# Altium schematic sheet E-10 PMIC.SchDoc: FRDM-IMX93
size 513 x 386 mm; DrawnBy: FORLINX; Organization: ORGANIZATION; Address1: ADDRESS 1; Address2: ADDRESS 2; Address3: ADDRESS 3; Address4: ADDRESS 4; Revision: -; ENG_APP_DATE: --/--/--; DSN_APP_DATE: --/--/--; CHK_APP_DATE: --/--/--; Classification: Public, Company Internal/Proprietary, Company Confidential,  Company Secret; Page Create Date: March  8, 1995; OrgName: NXP Semiconductor; FIUO: A; OrgAddr1: NO. 192 Liangjing Rd. Pudong New Area, ShangHai; Page Number: 10; PageTitle: PMIC; Page Size: C; Page Count: 23; Designer: FORLINX; RevCode: B1; Approver: NXP SE; Doc: SCH-94611 PDF: SPF-94611; DsnPath: T:\FILES\Designs\Single Board Computers\i.MX93-FRDM\Design Files\SCH-94611_B1.DSN; SchematicName: FRDM-i.MX 93 Development Board; PageName: E-10 PMIC; PageSize: C; TopSchematic: True
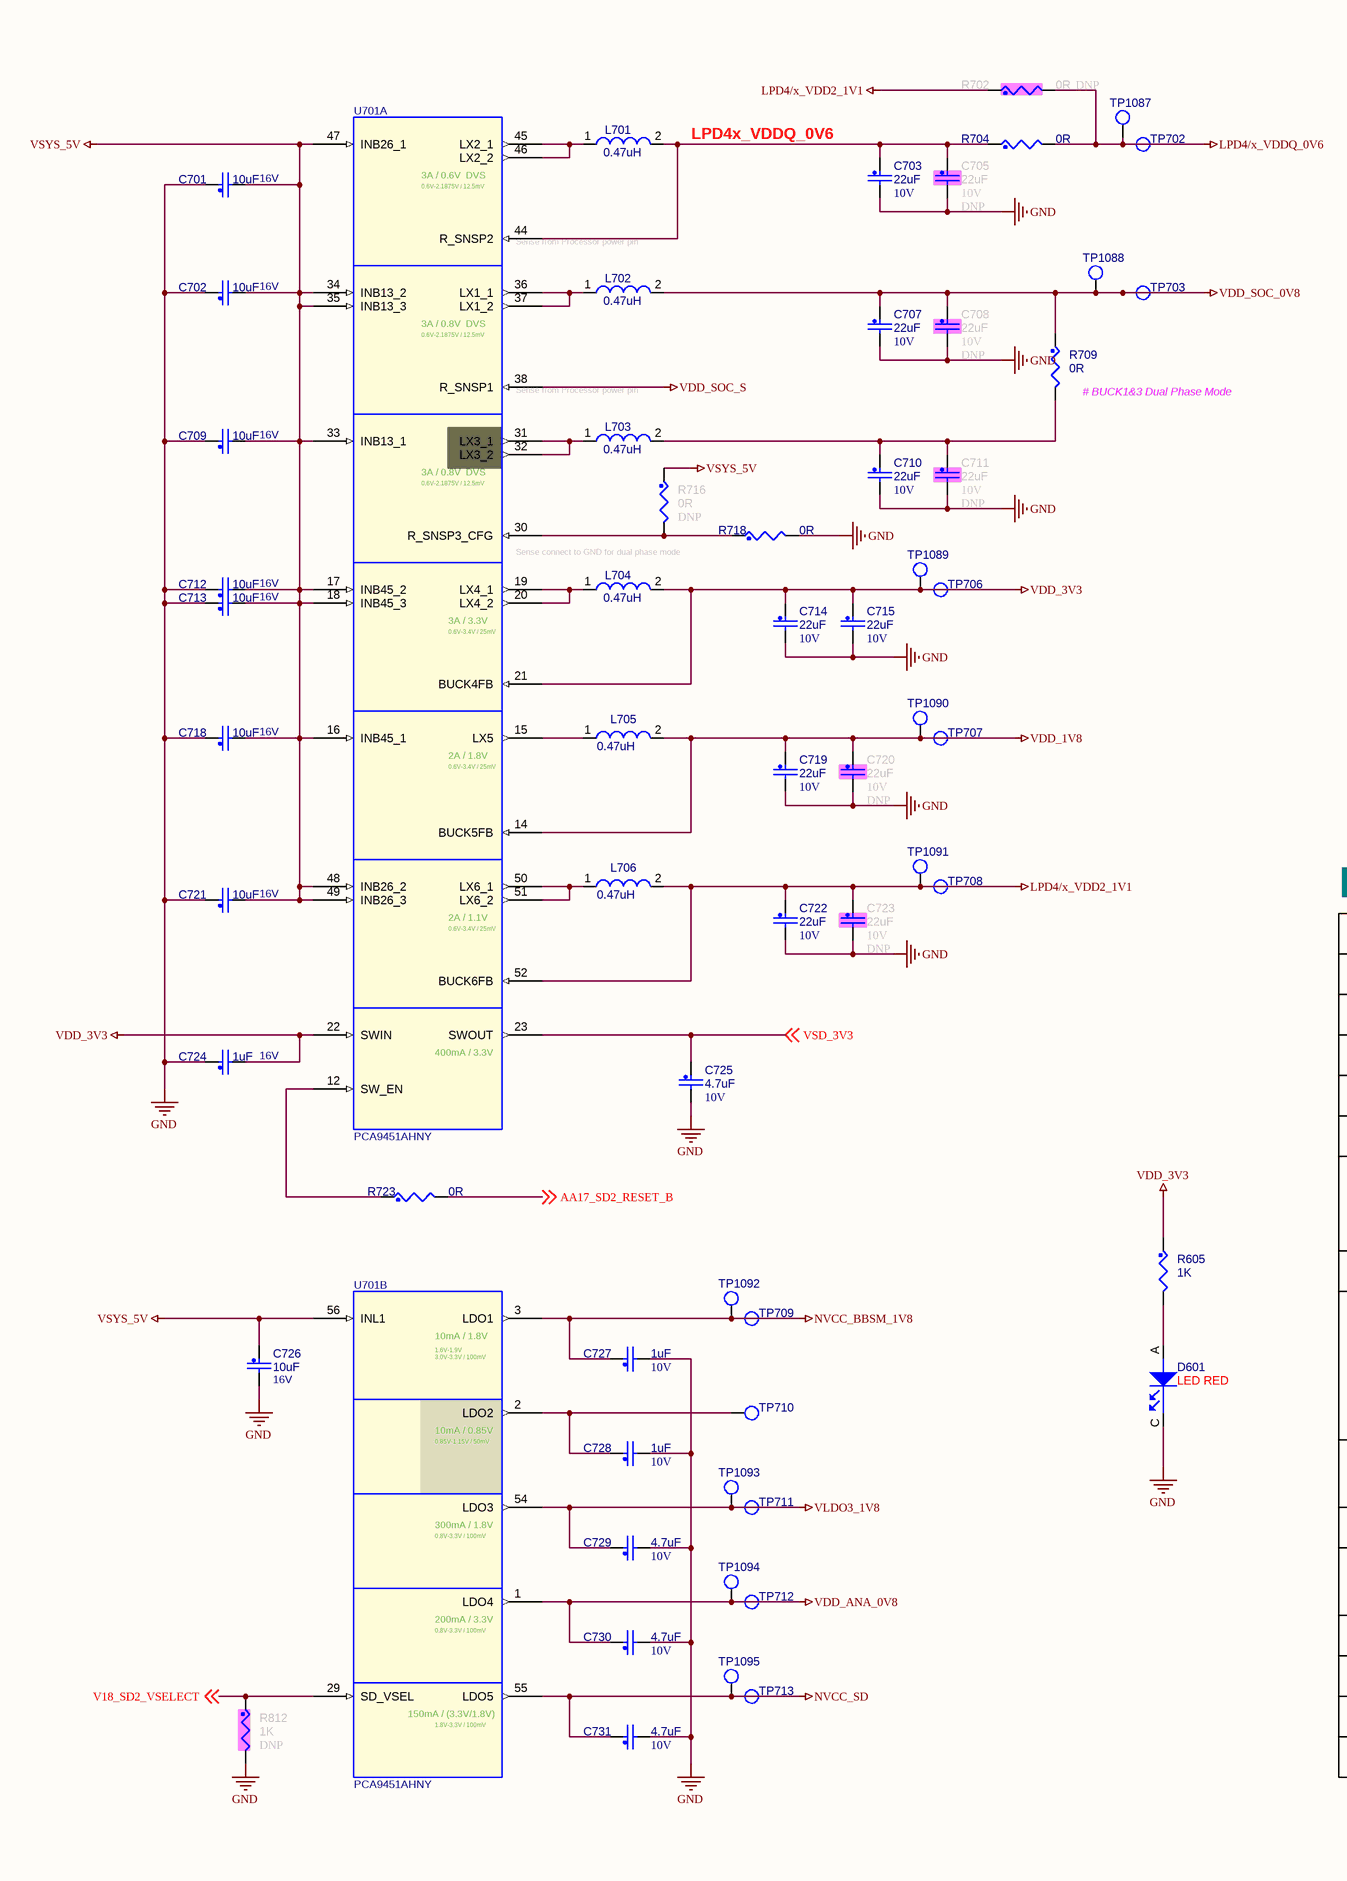
[diagram p0: E-10 PMIC.SchDoc, left]
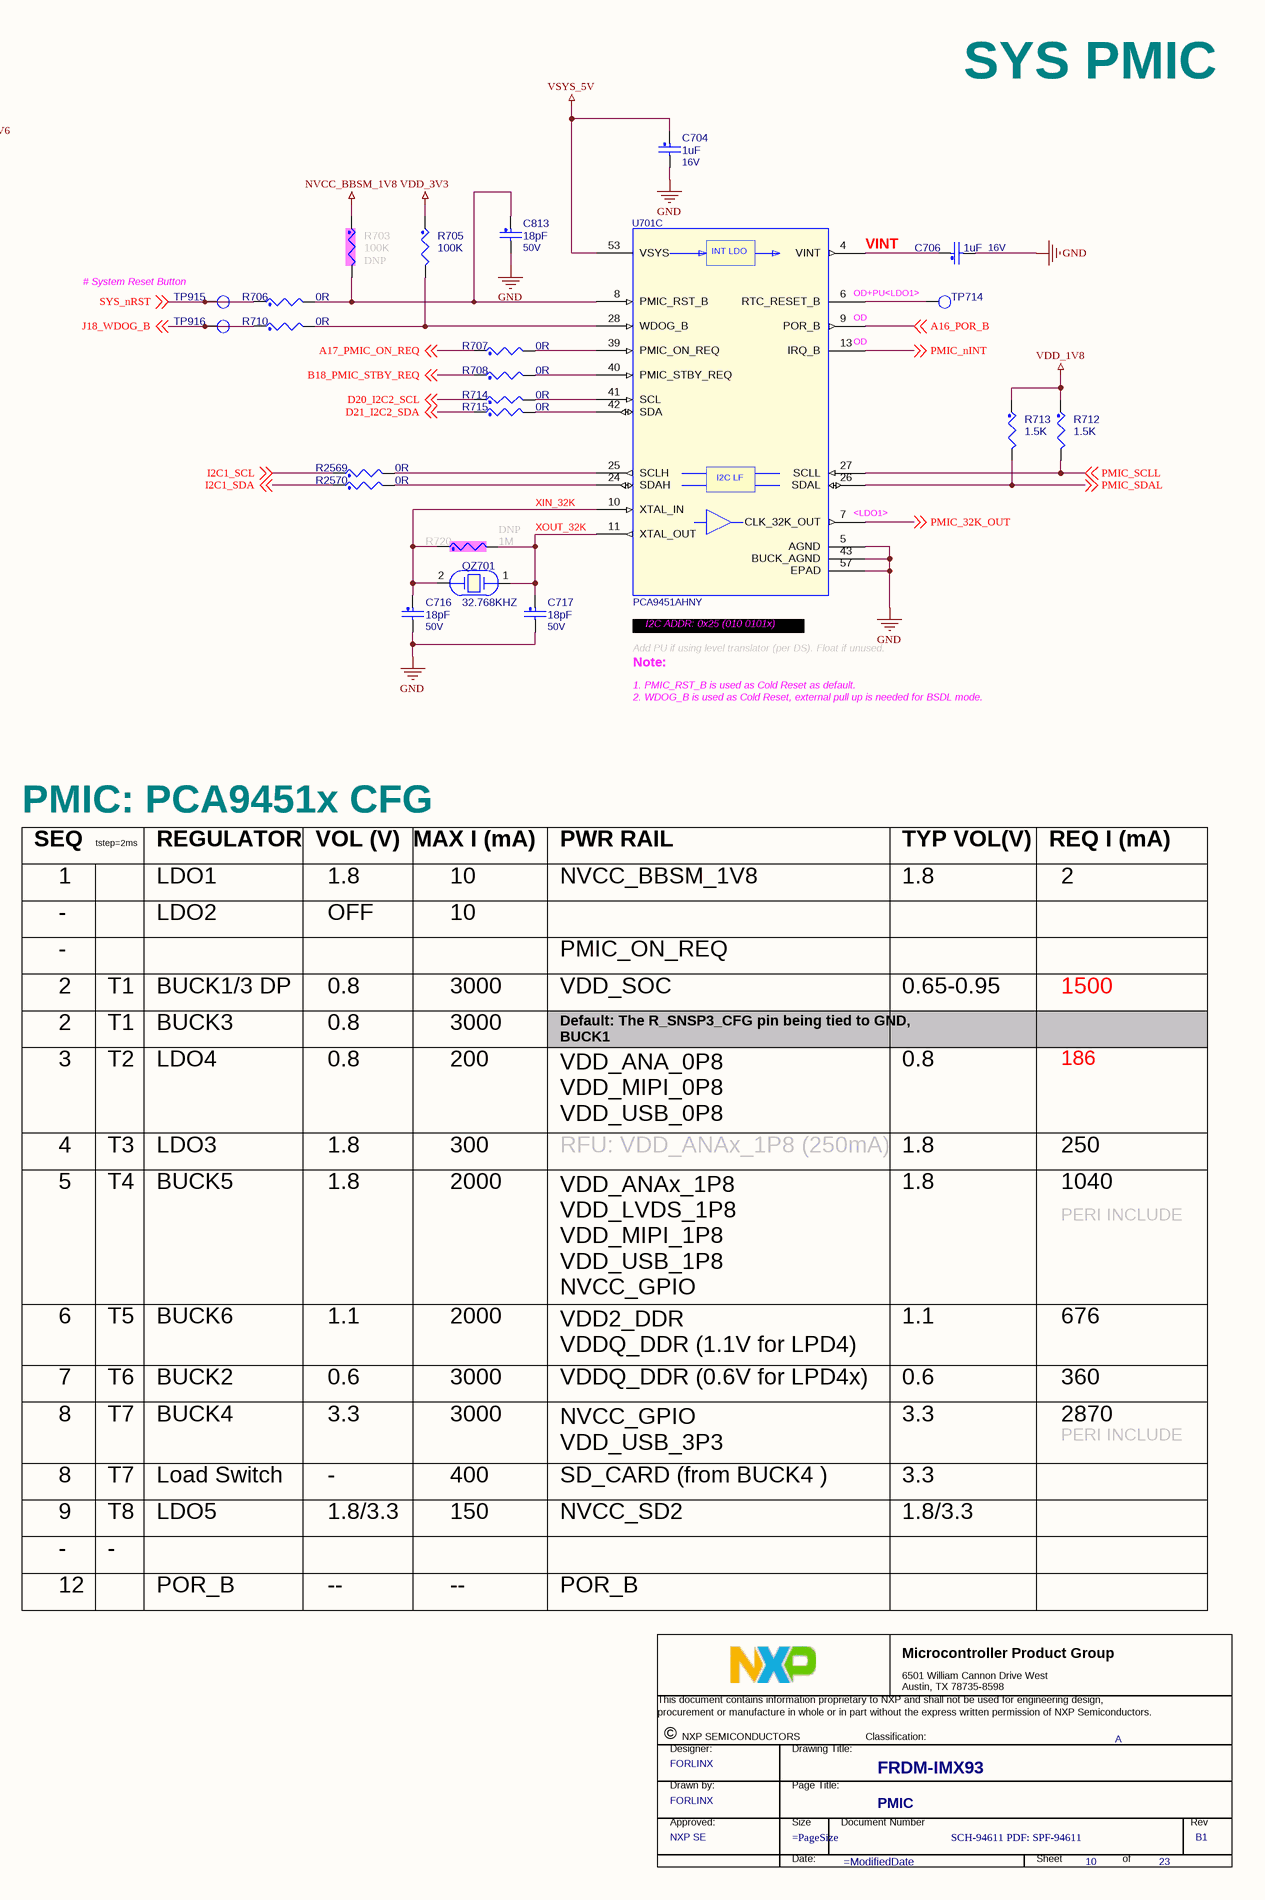
[diagram p1: E-10 PMIC.SchDoc, right]

## Parts
*  Title: FRDM-IMX93  RevCode: B1  PageTitle: PMIC  Page Number: 10  Page Count: 23  DrawnBy: FORLINX  Doc: SCH-94611 PDF: SPF-94611  Approver: NXP SE  FIUO: A  (graphical)
C701  10uF  VOLTAGE: 16V  [C0603]
C702  10uF  VOLTAGE: 16V  [C0603]
C703  22uF  VOLTAGE: 10V  [C0603]
C704  1uF  VOLTAGE: 16V  [C0402]
C705  22uF  ASSY_OPT: DNP  VOLTAGE: 10V  [C0603]
C706  1uF  VOLTAGE: 16V  [C0402]
C707  22uF  VOLTAGE: 10V  [C0603]
C708  22uF  ASSY_OPT: DNP  VOLTAGE: 10V  [C0603]
C709  10uF  VOLTAGE: 16V  [C0603]
C710  22uF  VOLTAGE: 10V  [C0603]
C711  22uF  ASSY_OPT: DNP  VOLTAGE: 10V  [C0603]
C712  10uF  VOLTAGE: 16V  [C0603]
C713  10uF  VOLTAGE: 16V  [C0603]
C714  22uF  VOLTAGE: 10V  [C0603]
C715  22uF  VOLTAGE: 10V  [C0603]
C716  18pF  VOLTAGE: 50V  [C0201]
C717  18pF  VOLTAGE: 50V  [C0201]
C718  10uF  VOLTAGE: 16V  [C0603]
C719  22uF  VOLTAGE: 10V  [C0603]
C720  22uF  ASSY_OPT: DNP  VOLTAGE: 10V  [C0603]
C721  10uF  VOLTAGE: 16V  [C0603]
C722  22uF  VOLTAGE: 10V  [C0603]
C723  22uF  ASSY_OPT: DNP  VOLTAGE: 10V  [C0603]
C724  1uF  VOLTAGE: 16V  [C0402]
C725  4.7uF  VOLTAGE: 10V  [C0402]
C726  10uF  VOLTAGE: 16V  [C0603]
C727  1uF  VOLTAGE: 10V  [C0201]
C728  1uF  VOLTAGE: 10V  [C0201]
C729  4.7uF  VOLTAGE: 10V  [C0402]
C730  4.7uF  VOLTAGE: 10V  [C0402]
C731  4.7uF  VOLTAGE: 10V  [C0402]
C813  18pF  VOLTAGE: 50V  [C0201]
D601  LED RED  [led0603]
L701  0.47uH  [IND_2016A]
L702  0.47uH  [IND_2016A]
L703  0.47uH  [IND_2016A]
L704  0.47uH  [IND_2016A]
L705  0.47uH  [IND_2016A]
L706  0.47uH  [IND_2016A]
QZ701  32.768KHZ  [XTAL2-3P2X1P5-SM]
R605  1K  [R0402]
R702  0R  ASSY_OPT: DNP  [R0603]
R703  100K  ASSY_OPT: DNP  [R0201]
R704  0R  [R0603]
R705  100K  [R0201]
R706  0R  [R0201]
R707  0R  [R0201]
R708  0R  [R0201]
R709  0R  [R0603]
R710  0R  [R0201]
R712  1.5K  [R0201]
R713  1.5K  [R0201]
R714  0R  [R0201]
R715  0R  [R0201]
R716  0R  ASSY_OPT: DNP  [R0402]
R718  0R  [R0402]
R720  1M  ASSY_OPT: DNP  [R0201]
R723  0R  [R0402]
R812  1K  ASSY_OPT: DNP  [R0402]
R2569  0R  [R0201]
R2570  0R  [R0201]
TP702  TPAD_020  [tpad_020]  (value not drawn)
TP703  TPAD_020  [tpad_020]  (value not drawn)
TP706  TPAD_020  [tpad_020]  (value not drawn)
TP707  TPAD_020  [tpad_020]  (value not drawn)
TP708  TPAD_020  [tpad_020]  (value not drawn)
TP709  TPAD_020  [tpad_020]  (value not drawn)
TP710  TPAD_020  [tpad_020]  (value not drawn)
TP711  TPAD_020  [tpad_020]  (value not drawn)
TP712  TPAD_020  [tpad_020]  (value not drawn)
TP713  TPAD_020  [tpad_020]  (value not drawn)
TP714  TPAD_015  [tpad_015]  (value not drawn)
TP915  TPAD_020  [tpad_020]  (value not drawn)
TP916  TPAD_020  [tpad_020]  (value not drawn)
TP1087  TPAD_020  [tpad_020]  (value not drawn)
TP1088  TPAD_020  [tpad_020]  (value not drawn)
TP1089  TPAD_020  [tpad_020]  (value not drawn)
TP1090  TPAD_020  [tpad_020]  (value not drawn)
TP1091  TPAD_020  [tpad_020]  (value not drawn)
TP1092  TPAD_020  [tpad_020]  (value not drawn)
TP1093  TPAD_020  [tpad_020]  (value not drawn)
TP1094  TPAD_020  [tpad_020]  (value not drawn)
TP1095  TPAD_020  [tpad_020]  (value not drawn)
U701  PCA9451AHNY  [hvqfn56_0p4_7x7_ep4p7mm]  (parts A,B,C of 3)

## Nets
GND: C701.1 C702.1 C703.2 C704.2 C705.2 C706.2 C707.2 C708.2 C709.1 C710.2 C711.2 C712.1 C713.1 C714.2 C715.2 C716.2 C717.2 C718.1 C719.2 C720.2 C721.1 C722.2 C723.2 C724.1 C725.2 C726.2 C727.2 C728.2 C729.2 C730.2 C731.2 C813.2 D601.C(CATHODE) R718.2 R812.2 U701.5(AGND) U701.43(BUCK_AGND) U701.57(EPAD)
LPD4/x_VDD2_1V1: C722.1 C723.1 L706.2 R702.1 TP708.1(TP) TP1091.1(TP) U701.52(BUCK6FB)
LPD4/x_VDDQ_0V6: R702.2 R704.2 TP702.1(TP) TP1087.1(TP)
NVCC_BBSM_1V8: C727.1 R703.1 TP709.1(TP) TP1092.1(TP) U701.3(LDO1)
NVCC_SD: C731.1 TP713.1(TP) TP1095.1(TP) U701.55(LDO5)
VDD_1V8: C719.1 C720.1 L705.2 R712.1 R713.1 TP707.1(TP) TP1090.1(TP) U701.14(BUCK5FB)
VDD_3V3: C714.1 C715.1 C724.2 L704.2 R605.1 R705.1 TP706.1(TP) TP1089.1(TP) U701.21(BUCK4FB) U701.22(SWIN)
VDD_ANA_0V8: C730.1 TP712.1(TP) TP1094.1(TP) U701.1(LDO4)
VDD_SOC_0V8: C707.1 C708.1 L702.2 R709.1 TP703.1(TP) TP1088.1(TP)
VDD_SOC_S: U701.38(R_SNSP1)
VLDO3_1V8: C729.1 TP711.1(TP) TP1093.1(TP) U701.54(LDO3)
VSYS_5V: C701.2 C702.2 C704.1 C709.2 C712.2 C713.2 C718.2 C721.2 C726.1 R716.1 U701.16(INB45_1) U701.17(INB45_2) U701.18(INB45_3) U701.33(INB13_1) U701.34(INB13_2) U701.35(INB13_3) U701.47(INB26_1) U701.48(INB26_2) U701.49(INB26_3) U701.53(VSYS) U701.56(INL1)
A16_POR_B: U701.9(POR_B) ; off-sheet A16_POR_B
A17_PMIC_ON_REQ: R707.1 ; off-sheet A17_PMIC_ON_REQ
AA17_SD2_RESET_B: R723.2 ; off-sheet AA17_SD2_RESET_B
B18_PMIC_STBY_REQ: R708.1 ; off-sheet B18_PMIC_STBY_REQ
D20_I2C2_SCL: R714.1 ; off-sheet D20_I2C2_SCL
D21_I2C2_SDA: R715.1 ; off-sheet D21_I2C2_SDA
I2C1_SCL: R2569.1 ; off-sheet I2C1_SCL
I2C1_SDA: R2570.1 ; off-sheet I2C1_SDA
J18_WDOG_B: R710.1 TP916.1(TP) ; off-sheet J18_WDOG_B
LPD4x_VDDQ_0V6: C703.1 C705.1 L701.2 R704.1 U701.44(R_SNSP2)
PMIC_32K_OUT: U701.7(CLK_32K_OUT) ; off-sheet PMIC_32K_OUT
PMIC_nINT: U701.13(IRQ_B) ; off-sheet PMIC_nINT
PMIC_SCLL: R712.2 U701.27(SCLL) ; off-sheet PMIC_SCLL
PMIC_SDAL: R713.2 U701.26(SDAL) ; off-sheet PMIC_SDAL
SYS_nRST: R706.1 TP915.1(TP) ; off-sheet SYS_nRST
V18_SD2_VSELECT: R812.1 U701.29(SD_VSEL) ; off-sheet V18_SD2_VSELECT
VINT: C706.1 U701.4(VINT)
VSD_3V3: C725.1 U701.23(SWOUT) ; off-sheet VSD_3V3
XIN_32K: C716.1 QZ701.2 R720.1 U701.10(XTAL_IN)
XOUT_32K: C717.1 QZ701.1 R720.2 U701.11(XTAL_OUT)
NetC710_1: C710.1 C711.1 L703.2 R709.2
NetC728_1: C728.1 TP710.1(TP) U701.2(LDO2)
NetC813_1: C813.1 R703.2 R706.2 U701.8(PMIC_RST_B)
NetD601_A: D601.A(ANODE) R605.2
NetL701_1: L701.1 U701.45(LX2_1) U701.46(LX2_2)
NetL702_1: L702.1 U701.36(LX1_1) U701.37(LX1_2)
NetL703_1: L703.1 U701.31(LX3_1) U701.32(LX3_2)
NetL704_1: L704.1 U701.19(LX4_1) U701.20(LX4_2)
NetL705_1: L705.1 U701.15(LX5)
NetL706_1: L706.1 U701.50(LX6_1) U701.51(LX6_2)
NetR705_2: R705.2 R710.2 U701.28(WDOG_B)
NetR707_2: R707.2 U701.39(PMIC_ON_REQ)
NetR708_2: R708.2 U701.40(PMIC_STBY_REQ)
NetR714_2: R714.2 U701.41(SCL)
NetR715_2: R715.2 U701.42(SDA)
NetR716_2: R716.2 R718.1 U701.30(R_SNSP3_CFG)
NetR723_1: R723.1 U701.12(SW_EN)
NetR2569_2: R2569.2 U701.25(SCLH)
NetR2570_2: R2570.2 U701.24(SDAH)
NetTP714_1: TP714.1(TP) U701.6(RTC_RESET_B)

## Notes on the sheet
- SYS PMIC
- (near U701) 3A / 0.6V  DVS
- (near U701) 0.6V-2.1875V / 12.5mV
- (near U701) Sense from Processor power pin
- (near U701) 3A / 0.8V  DVS
- # System Reset Button
- OD+PU<LDO1>
- (near R709) # BUCK1&3 Dual Phase Mode
- (near U701) OD
- (near U701) Sense connect to GND for dual phase mode
- (near U701) <LDO1>
- (near U701) 0.6V-3.4V / 25mV
- (near U701) 3A / 3.3V
- Note:
- Add PU if using level translator (per DS). Float if unused.
- I2C ADDR: 0x25 (010 0101x)
- (near U701) 2A / 1.8V
- 1. PMIC_RST_B is used as Cold Reset as default.
- 2. WDOG_B is used as Cold Reset, external pull up is needed for BSDL mode.
- (near U701) 2A / 1.1V
- PMIC: PCA9451x CFG
- SEQ
- tstep=2ms
- REGULATOR
- VOL (V)
- MAX I (mA)
- PWR RAIL
- TYP VOL(V)
- REQ I (mA)
- -
- 1
- LDO1
- LDO2
- OFF
- 1.8
- 10
- NVCC_BBSM_1V8
- 2
- (near U701) 400mA / 3.3V
- PMIC_ON_REQ
- T1
- BUCK1/3 DP
- BUCK3
- 0.8
- 3000
- VDD_SOC
- Default: The R_SNSP3_CFG pin being tied to GND, BUCK1
  and BUCK3 are configured as dual phase mode. Curr 6A.
- 0.65-0.95
- 1500
- 3
- T2
- LDO4
- 200
- 186
- 4
- T3
- LDO3
- 300
- RFU: VDD_ANAx_1P8 (250mA)
- VDD_ANA_0P8
  VDD_MIPI_0P8
  VDD_USB_0P8
- 250
- (near U701) 1.6V-1.9V
  3.0V-3.3V / 100mV
- (near U701) 10mA / 1.8V
- 5
- T4
- BUCK5
- 2000
- 1040
- PERI INCLUDE
- VDD_ANAx_1P8
  VDD_LVDS_1P8
  VDD_MIPI_1P8
  VDD_USB_1P8
  NVCC_GPIO
- (near U701) 0.85V-1.15V / 50mV
- (near U701) 10mA / 0.85V
- 6
- T5
- BUCK6
- 1.1
- VDD2_DDR
  VDDQ_DDR (1.1V for LPD4)
- 676
- (near U701) 0.8V-3.3V / 100mV
- (near U701) 300mA / 1.8V
- 7
- T6
- BUCK2
- 0.6
- VDDQ_DDR (0.6V for LPD4x)
- 360
- (near U701) 200mA / 3.3V
- 8
- T7
- BUCK4
- 3.3
- NVCC_GPIO
  VDD_USB_3P3
- 2870
- 9
- T8
- LDO5
- Load Switch
- 1.8/3.3
- 150
- 400
- SD_CARD (from BUCK4 )
- NVCC_SD2
- (near U701) 150mA / (3.3V/1.8V)
- (near U701) 1.8V-3.3V / 100mV
- 12
- POR_B
- --
- DWG. NO.
- REV.
- SHT.
- REVISION
- DESCRIPTION
- DATE
- APPROVED
- ENG:
- APPROVALS
- quilter.ai <http://quilter.ai>
- DSN:
- CHK:
- REFERENCE DOCUMENTS
- TITLE
- PROJECT
- BOM:
- FAB DWG:
- PCB DWG:
- ASSY DWG:
- SIZE
- FILE NAME
- C
- DWG NO.
- SHEET
- OF
- REV
- (in symbol PCA9451AHNY, part C) INT LDO; I2C LF
- (in symbol TitleBlock_MCPG) Microcontroller Product Group; 6501 William Cannon Drive West / Austin, TX 78735-8598; This document contains information proprietary to NXP and shall not be used for engineering design,; procurement or manufacture in whole or in part without the express written permission of NXP Semiconductors.; ©; NXP SEMICONDUCTORS; Classification:; Designer:; Drawing Title:; Drawn by:; Page Title:; Approved:; Size; Document Number; Rev; Date:; Sheet; of

## Library data of the parts
* = TitleBlock_MCPG: Classification: Public, Company Internal/Proprietary, Company Confidential,  Company Secret; OrgAddr1: NO. 192 Liangjing Rd. Pudong New Area, ShangHai; OrgName: NXP Semiconductor; Page Size: =PageSize; Page Create Date: March  8, 1995; Designer: FORLINX; Page Modify Date: =ModifiedDate
C701 = CAP_NP: 0603,10uF,10V,+/-20%,X5R; Part Reference: C701; CLASS: DISCRETE; Temp Range: -55¡ãC to +85¡ãC; FPLIST: CC0603_OV,CC0603,0603_CC,cc0603_0805_nsp; CAD_APPROVED: Yes; MFG_PN01: 0603X106M100NT; MFG_NAME01: FENGHUA; Tolerance: 10%; Value: 10uF; Package Type: SMT; Package Size: 0603; HEIGHT: 0.9MM; Temp_Range: -55¡ãC to +85¡ãC; ROHS: Yes; PCB Footprint: C0603
C702 = CAP_NP: 0603,10uF,10V,+/-20%,X5R; Part Reference: C702; CLASS: DISCRETE; Temp Range: -55¡ãC to +85¡ãC; Tolerance: 10%; MFG_NAME01: FENGHUA; MFG_PN01: 0603X106M100NT; CAD_APPROVED: Yes; FPLIST: CC0603_OV,CC0603,0603_CC,cc0603_0805_nsp; Value: 10uF; Package Type: SMT; Package Size: 0603; ROHS: Yes; Temp_Range: -55¡ãC to +85¡ãC; HEIGHT: 0.9MM; PCB Footprint: C0603
C703 = CAP_NP: 0603,22uF,6.3V,+/-20%,X5R; Part Reference: C703; CLASS: DISCRETE; SIGNAL_MODEL: DEFAULT_CAPACITOR_2.2e+07pF_2_1; Tolerance: 20%; MFG_NAME01: SAMSUNG; MFG_PN01: CL10A226MQ8NRNC; CAD_APPROVED: Yes; FPLIST: CC0603_OV,CC0603,0603_cc_tol; Value: 22uF; Package Size: 0603; WVDC: 6.3V; ROHS: Yes; HEIGHT: 1MM; PCB Footprint: C0603
C704 = CAP_NP: 0402,1uF,16V,+/-10%,X5R; Part Reference: C704; CLASS: DISCRETE; MFG_PN01: CL05A105KO5NNNC; MFG_NAME01: SAMSUNG; CAD_APPROVED: Yes; Tolerance: 10%; FPLIST: CC0402_25,CC0402_HD,0402_CC,capc0402_l; Value: 1uF; ROHS: Yes; HEIGHT: 0.55 MM; PCB Footprint: C0402
C705 = CAP_NP: 0603,22uF,6.3V,+/-20%,X5R; Part Reference: C705; CLASS: DISCRETE; Tolerance: 20%; MFG_NAME01: SAMSUNG; MFG_PN01: CL10A226MQ8NRNC; CAD_APPROVED: Yes; FPLIST: CC0603_OV,CC0603,0603_cc_tol; SIGNAL_MODEL: DEFAULT_CAPACITOR_2.2e+07pF_2_1; Value: 22uF; Package Size: 0603; WVDC: 6.3V; ROHS: Yes; HEIGHT: 1MM; PCB Footprint: C0603
C706 = CAP_NP: 0402,1uF,16V,+/-10%,X5R; Part Reference: C706; CLASS: DISCRETE; FPLIST: CC0402_25,CC0402_HD,0402_CC,capc0402_l; Tolerance: 10%; CAD_APPROVED: Yes; MFG_NAME01: SAMSUNG; MFG_PN01: CL05A105KO5NNNC; Value: 1uF; HEIGHT: 0.55 MM; ROHS: Yes; PCB Footprint: C0402
C707 = CAP_NP: 0603,22uF,6.3V,+/-20%,X5R; Part Reference: C707; CLASS: DISCRETE; FPLIST: CC0603_OV,CC0603,0603_cc_tol; CAD_APPROVED: Yes; MFG_PN01: CL10A226MQ8NRNC; MFG_NAME01: SAMSUNG; Tolerance: 20%; SIGNAL_MODEL: DEFAULT_CAPACITOR_2.2e+07pF_2_1; Value: 22uF; Package Size: 0603; HEIGHT: 1MM; ROHS: Yes; WVDC: 6.3V; PCB Footprint: C0603
C708 = CAP_NP: 0603,22uF,6.3V,+/-20%,X5R; Part Reference: C708; CLASS: DISCRETE; SIGNAL_MODEL: DEFAULT_CAPACITOR_2.2e+07pF_2_1; FPLIST: CC0603_OV,CC0603,0603_cc_tol; CAD_APPROVED: Yes; MFG_PN01: CL10A226MQ8NRNC; MFG_NAME01: SAMSUNG; Tolerance: 20%; Value: 22uF; HEIGHT: 1MM; ROHS: Yes; WVDC: 6.3V; Package Size: 0603; PCB Footprint: C0603
C709 = CAP_NP: 0603,10uF,10V,+/-20%,X5R; Part Reference: C709; CLASS: DISCRETE; Temp Range: -55¡ãC to +85¡ãC; Tolerance: 10%; MFG_NAME01: FENGHUA; MFG_PN01: 0603X106M100NT; CAD_APPROVED: Yes; FPLIST: CC0603_OV,CC0603,0603_CC,cc0603_0805_nsp; Value: 10uF; Package Type: SMT; Package Size: 0603; ROHS: Yes; Temp_Range: -55¡ãC to +85¡ãC; HEIGHT: 0.9MM; PCB Footprint: C0603
C710 = CAP_NP: 0603,22uF,6.3V,+/-20%,X5R; Part Reference: C710; CLASS: DISCRETE; SIGNAL_MODEL: DEFAULT_CAPACITOR_2.2e+07pF_2_1; Tolerance: 20%; MFG_NAME01: SAMSUNG; MFG_PN01: CL10A226MQ8NRNC; CAD_APPROVED: Yes; FPLIST: CC0603_OV,CC0603,0603_cc_tol; Value: 22uF; Package Size: 0603; WVDC: 6.3V; ROHS: Yes; HEIGHT: 1MM; PCB Footprint: C0603
C711 = CAP_NP: 0603,22uF,6.3V,+/-20%,X5R; Part Reference: C711; CLASS: DISCRETE; Tolerance: 20%; MFG_NAME01: SAMSUNG; MFG_PN01: CL10A226MQ8NRNC; CAD_APPROVED: Yes; FPLIST: CC0603_OV,CC0603,0603_cc_tol; SIGNAL_MODEL: DEFAULT_CAPACITOR_2.2e+07pF_2_1; Value: 22uF; WVDC: 6.3V; ROHS: Yes; HEIGHT: 1MM; Package Size: 0603; PCB Footprint: C0603
C712 = CAP_NP: 0603,10uF,10V,+/-20%,X5R; Part Reference: C712; CLASS: DISCRETE; FPLIST: CC0603_OV,CC0603,0603_CC,cc0603_0805_nsp; CAD_APPROVED: Yes; Temp_Range: -55¡ãC to +85¡ãC; MFG_PN01: 0603X106M100NT; MFG_NAME01: FENGHUA; Tolerance: 10%; Value: 10uF; HEIGHT: 0.9MM; ROHS: Yes; Package Size: 0603; Package Type: SMT; Temp Range: -55¡ãC to +85¡ãC; PCB Footprint: C0603
C713 = CAP_NP: 0603,10uF,10V,+/-20%,X5R; Part Reference: C713; CLASS: DISCRETE; Temp Range: -55¡ãC to +85¡ãC; Tolerance: 10%; MFG_NAME01: FENGHUA; MFG_PN01: 0603X106M100NT; CAD_APPROVED: Yes; FPLIST: CC0603_OV,CC0603,0603_CC,cc0603_0805_nsp; Value: 10uF; Package Type: SMT; Package Size: 0603; ROHS: Yes; Temp_Range: -55¡ãC to +85¡ãC; HEIGHT: 0.9MM; PCB Footprint: C0603
C714 = CAP_NP: 0603,22uF,6.3V,+/-20%,X5R; Part Reference: C714; CLASS: DISCRETE; SIGNAL_MODEL: DEFAULT_CAPACITOR_2.2e+07pF_2_1; Tolerance: 20%; MFG_NAME01: SAMSUNG; MFG_PN01: CL10A226MQ8NRNC; CAD_APPROVED: Yes; FPLIST: CC0603_OV,CC0603,0603_cc_tol; Value: 22uF; Package Size: 0603; WVDC: 6.3V; ROHS: Yes; HEIGHT: 1MM; PCB Footprint: C0603
C715 = CAP_NP: 0603,22uF,6.3V,+/-20%,X5R; Part Reference: C715; CLASS: DISCRETE; SIGNAL_MODEL: DEFAULT_CAPACITOR_2.2e+07pF_2_1; FPLIST: CC0603_OV,CC0603,0603_cc_tol; CAD_APPROVED: Yes; MFG_PN01: CL10A226MQ8NRNC; MFG_NAME01: SAMSUNG; Tolerance: 20%; Value: 22uF; Package Size: 0603; HEIGHT: 1MM; ROHS: Yes; WVDC: 6.3V; PCB Footprint: C0603
C716 = CAP_NP: 0201,18pF,50V,+/-5%,NPO; Part Reference: C716; CLASS: DISCRETE; FPLIST: CC0201,CC0201_HD,0201_CC; CAD_APPROVED: Yes; MFG_PN01: 0201CG180J500NT; MFG_NAME01: FENGHUA; Tolerance: 5%; Value: 18pF; Package Type: &#966;180mm Paper taping; Package Size: 0201; HEIGHT: 0.33MM; ROHS: Yes; PCB Footprint: C0201
C717 = CAP_NP: 0201,18pF,50V,+/-5%,NPO; Part Reference: C717; CLASS: DISCRETE; FPLIST: CC0201,CC0201_HD,0201_CC; CAD_APPROVED: Yes; MFG_PN01: 0201CG180J500NT; MFG_NAME01: FENGHUA; Tolerance: 5%; Value: 18pF; HEIGHT: 0.33MM; ROHS: Yes; Package Size: 0201; Package Type: &#966;180mm Paper taping; PCB Footprint: C0201
C718 = CAP_NP: 0603,10uF,10V,+/-20%,X5R; Part Reference: C718; CLASS: DISCRETE; FPLIST: CC0603_OV,CC0603,0603_CC,cc0603_0805_nsp; CAD_APPROVED: Yes; Temp_Range: -55¡ãC to +85¡ãC; MFG_PN01: 0603X106M100NT; MFG_NAME01: FENGHUA; Tolerance: 10%; Value: 10uF; HEIGHT: 0.9MM; ROHS: Yes; Package Size: 0603; Package Type: SMT; Temp Range: -55¡ãC to +85¡ãC; PCB Footprint: C0603
C719 = CAP_NP: 0603,22uF,6.3V,+/-20%,X5R; Part Reference: C719; CLASS: DISCRETE; SIGNAL_MODEL: DEFAULT_CAPACITOR_2.2e+07pF_2_1; Tolerance: 20%; MFG_NAME01: SAMSUNG; MFG_PN01: CL10A226MQ8NRNC; CAD_APPROVED: Yes; FPLIST: CC0603_OV,CC0603,0603_cc_tol; Value: 22uF; Package Size: 0603; WVDC: 6.3V; ROHS: Yes; HEIGHT: 1MM; PCB Footprint: C0603
C720 = CAP_NP: 0603,22uF,6.3V,+/-20%,X5R; Part Reference: C720; CLASS: DISCRETE; SIGNAL_MODEL: DEFAULT_CAPACITOR_2.2e+07pF_2_1; FPLIST: CC0603_OV,CC0603,0603_cc_tol; CAD_APPROVED: Yes; MFG_PN01: CL10A226MQ8NRNC; MFG_NAME01: SAMSUNG; Tolerance: 20%; Value: 22uF; Package Size: 0603; HEIGHT: 1MM; ROHS: Yes; WVDC: 6.3V; PCB Footprint: C0603
C721 = CAP_NP: 0603,10uF,10V,+/-20%,X5R; Part Reference: C721; CLASS: DISCRETE; FPLIST: CC0603_OV,CC0603,0603_CC,cc0603_0805_nsp; CAD_APPROVED: Yes; Temp_Range: -55¡ãC to +85¡ãC; MFG_PN01: 0603X106M100NT; MFG_NAME01: FENGHUA; Tolerance: 10%; Value: 10uF; HEIGHT: 0.9MM; ROHS: Yes; Package Size: 0603; Package Type: SMT; Temp Range: -55¡ãC to +85¡ãC; PCB Footprint: C0603
C722 = CAP_NP: 0603,22uF,6.3V,+/-20%,X5R; Part Reference: C722; CLASS: DISCRETE; SIGNAL_MODEL: DEFAULT_CAPACITOR_2.2e+07pF_2_1; Tolerance: 20%; MFG_NAME01: SAMSUNG; MFG_PN01: CL10A226MQ8NRNC; CAD_APPROVED: Yes; FPLIST: CC0603_OV,CC0603,0603_cc_tol; Value: 22uF; Package Size: 0603; WVDC: 6.3V; ROHS: Yes; HEIGHT: 1MM; PCB Footprint: C0603
C723 = CAP_NP: 0603,22uF,6.3V,+/-20%,X5R; Part Reference: C723; CLASS: DISCRETE; Tolerance: 20%; MFG_NAME01: SAMSUNG; MFG_PN01: CL10A226MQ8NRNC; CAD_APPROVED: Yes; FPLIST: CC0603_OV,CC0603,0603_cc_tol; SIGNAL_MODEL: DEFAULT_CAPACITOR_2.2e+07pF_2_1; Value: 22uF; WVDC: 6.3V; ROHS: Yes; HEIGHT: 1MM; Package Size: 0603; PCB Footprint: C0603
C724 = CAP_NP: 0402,1uF,16V,+/-10%,X5R; Part Reference: C724; CLASS: DISCRETE; MFG_PN01: CL05A105KO5NNNC; MFG_NAME01: SAMSUNG; CAD_APPROVED: Yes; Tolerance: 10%; FPLIST: CC0402_25,CC0402_HD,0402_CC,capc0402_l; Value: 1uF; ROHS: Yes; HEIGHT: 0.55 MM; PCB Footprint: C0402
C725 = CAP_NP: 0402,4.7uF,10V,+/-10%,X5R; Part Reference: C725; CLASS: DISCRETE; 3D_Mechanical_Footprint_File: cc0402_tol0p15; FPLIST: cc0402_tol0p15,cc0402_tol0p15_ov,0402_cc_nsp; CAD_APPROVED: Yes; MFG_PN01: CL05A475KP5NRNC; MFG_NAME01: SAMSUNG; Tolerance: 10%; Value: 4.7uF; HEIGHT: 0.65MM; ROHS: Yes; PCB Footprint: C0402
C726 = CAP_NP: 0603,10uF,10V,+/-20%,X5R; Part Reference: C726; CLASS: DISCRETE; Temp Range: -55¡ãC to +85¡ãC; FPLIST: CC0603_OV,CC0603,0603_CC,cc0603_0805_nsp; CAD_APPROVED: Yes; MFG_PN01: 0603X106M100NT; MFG_NAME01: FENGHUA; Tolerance: 10%; Value: 10uF; Package Type: SMT; Package Size: 0603; HEIGHT: 0.9MM; Temp_Range: -55¡ãC to +85¡ãC; ROHS: Yes; PCB Footprint: C0603
C727 = CAP_NP: 0201,1uF,10V,+/-20%,X5R; Part Reference: C727; CLASS: DISCRETE; Tolerance: 10%; MFG_NAME01: SAMSUNG; MFG_PN01: CL03A105MP3NSNC; CAD_APPROVED: Yes; FPLIST: CC0201,CC0201_HD,0201_CC,cc_0201_cir; Temp Range: -55¡ãC to 85¡ãC; Value: 1uF; ROHS: Yes; HEIGHT: 0.35MM; Package Size: 0201 (0603 Metric); Package Type: SMD/SMT; PCB Footprint: C0201
C728 = CAP_NP: 0201,1uF,10V,+/-20%,X5R; Part Reference: C728; CLASS: DISCRETE; Tolerance: 10%; MFG_NAME01: SAMSUNG; MFG_PN01: CL03A105MP3NSNC; CAD_APPROVED: Yes; FPLIST: CC0201,CC0201_HD,0201_CC,cc_0201_cir; Temp Range: -55¡ãC to 85¡ãC; Value: 1uF; Package Type: SMD/SMT; Package Size: 0201 (0603 Metric); ROHS: Yes; HEIGHT: 0.35MM; PCB Footprint: C0201
C729 = CAP_NP: 0402,4.7uF,10V,+/-10%,X5R; Part Reference: C729; CLASS: DISCRETE; 3D_Mechanical_Footprint_File: cc0402_tol0p15; Tolerance: 10%; MFG_NAME01: SAMSUNG; MFG_PN01: CL05A475KP5NRNC; CAD_APPROVED: Yes; FPLIST: cc0402_tol0p15,cc0402_tol0p15_ov,0402_cc_nsp; Value: 4.7uF; ROHS: Yes; HEIGHT: 0.65MM; PCB Footprint: C0402
C730 = CAP_NP: 0402,4.7uF,10V,+/-10%,X5R; Part Reference: C730; CLASS: DISCRETE; 3D_Mechanical_Footprint_File: cc0402_tol0p15; Tolerance: 10%; MFG_NAME01: SAMSUNG; MFG_PN01: CL05A475KP5NRNC; CAD_APPROVED: Yes; FPLIST: cc0402_tol0p15,cc0402_tol0p15_ov,0402_cc_nsp; Value: 4.7uF; ROHS: Yes; HEIGHT: 0.65MM; PCB Footprint: C0402
C731 = CAP_NP: 0402,4.7uF,10V,+/-10%,X5R; Part Reference: C731; CLASS: DISCRETE; 3D_Mechanical_Footprint_File: cc0402_tol0p15; Tolerance: 10%; MFG_NAME01: SAMSUNG; MFG_PN01: CL05A475KP5NRNC; CAD_APPROVED: Yes; FPLIST: cc0402_tol0p15,cc0402_tol0p15_ov,0402_cc_nsp; Value: 4.7uF; ROHS: Yes; HEIGHT: 0.65MM; PCB Footprint: C0402
C813 = CAP_NP: 0201,18pF,50V,+/-5%,NPO; Part Reference: C813; CLASS: DISCRETE; Tolerance: 5%; MFG_NAME01: FENGHUA; MFG_PN01: 0201CG180J500NT; CAD_APPROVED: Yes; FPLIST: CC0201,CC0201_HD,0201_CC; Value: 18pF; Package Type: &#966;180mm Paper taping; Package Size: 0201; ROHS: Yes; HEIGHT: 0.33MM; PCB Footprint: C0201
D601 = LED: LED RED SGL 25MA SMT 0603; Part Reference: D601; CLASS: IC; VOLTAGE: 2V; MFG_NAME01: Harvatek; MFG_PN01: HQ19-2132SURC62(Y); CAD_APPROVED: Yes; Value: LED RED; ROHS: Yes; HEIGHT: 0.8 MM; PCB Footprint: led0603
L701 = INDUCTOR: 0.47uH+/-20%,2.0*1.6*1.2,3.4A/3.95A; Part Reference: L701; PART_TYPE: INDUCTOR\POWER; CLASS: DISCRETE; Tolerance: 20%; CAD_APPROVED: Yes; Temp_Range: -40¡ãC to +125¡ãC; MFG_PN01: WPN201612HR47MT; MFG_NAME01: Sunlord; Value: 0.47uH; HEIGHT: 1.2MM; ROHS: Yes; TOL: 20%; Temp Range: -40¡ãC to +125¡ãC; PCB Footprint: IND_2016A
L702 = INDUCTOR: 0.47uH+/-20%,2.0*1.6*1.2,3.4A/3.95A; Part Reference: L702; PART_TYPE: INDUCTOR\POWER; CLASS: DISCRETE; Temp Range: -40¡ãC to +125¡ãC; Tolerance: 20%; MFG_NAME01: Sunlord; MFG_PN01: WPN201612HR47MT; CAD_APPROVED: Yes; Value: 0.47uH; TOL: 20%; ROHS: Yes; Temp_Range: -40¡ãC to +125¡ãC; HEIGHT: 1.2MM; PCB Footprint: IND_2016A
L703 = INDUCTOR: 0.47uH+/-20%,2.0*1.6*1.2,3.4A/3.95A; Part Reference: L703; PART_TYPE: INDUCTOR\POWER; CLASS: DISCRETE; Temp Range: -40¡ãC to +125¡ãC; Tolerance: 20%; MFG_NAME01: Sunlord; MFG_PN01: WPN201612HR47MT; CAD_APPROVED: Yes; Value: 0.47uH; TOL: 20%; ROHS: Yes; Temp_Range: -40¡ãC to +125¡ãC; HEIGHT: 1.2MM; PCB Footprint: IND_2016A
L704 = INDUCTOR: 0.47uH+/-20%,2.0*1.6*1.2,3.4A/3.95A; Part Reference: L704; PART_TYPE: INDUCTOR\POWER; CLASS: DISCRETE; Temp Range: -40¡ãC to +125¡ãC; Tolerance: 20%; MFG_NAME01: Sunlord; MFG_PN01: WPN201612HR47MT; CAD_APPROVED: Yes; Value: 0.47uH; TOL: 20%; ROHS: Yes; Temp_Range: -40¡ãC to +125¡ãC; HEIGHT: 1.2MM; PCB Footprint: IND_2016A
L705 = INDUCTOR: 0.47uH+/-20%,2.0*1.6*1.2,3.4A/3.95A; Part Reference: L705; PART_TYPE: INDUCTOR\POWER; CLASS: DISCRETE; Temp Range: -40¡ãC to 125¡ãC; CAD_APPROVED: Yes; MFG_PN01: WPN201612HR47MT; MFG_NAME01: Sunlord; Tolerance: 20%; Value: 0.47uH; Package Size: 2x1.6x1.2 mm; HEIGHT: 1.2MM; Temp_Range: -40¡ãC to 125¡ãC; ROHS: Yes; PCB Footprint: IND_2016A
L706 = INDUCTOR: 0.47uH+/-20%,2.0*1.6*1.2,3.4A/3.95A; Part Reference: L706; PART_TYPE: INDUCTOR\POWER; CLASS: DISCRETE; Temp Range: -40¡ãC to 125¡ãC; Tolerance: 20%; MFG_NAME01: Sunlord; MFG_PN01: WPN201612HR47MT; CAD_APPROVED: Yes; Value: 0.47uH; Package Size: 2x1.6x1.2 mm; ROHS: Yes; Temp_Range: -40¡ãC to 125¡ãC; HEIGHT: 1.2MM; PCB Footprint: IND_2016A
QZ701 = XTAL: Crystal,32.768KHZ,3.2*1.5mm,+/-20ppm,12.5PF,S999-311,-40~85+C; Part Reference: QZ701; CLASS: IC; CAD_APPROVED: Yes; MFG_PN01: KK32768g33C; MFG_NAME01: Dongxin Hengke; Value: 32.768KHZ; HEIGHT: 0.9MM; ROHS: Yes; PCB Footprint: XTAL2-3P2X1P5-SM
R605 = RES: 0402,1K,+/-1%; Part Reference: R605; CLASS: DISCRETE; MFG_PN01: RC-02K1001FT; MFG_NAME01: FENGHUA; VOLTAGE: 1/16W; CAD_APPROVED: Yes; Tolerance: 1%; FPLIST: RC0402_25,RC0402_HD,RC0402_X2,0402_CC; Value: 1K; ROHS: Yes; HEIGHT: 0.4MM; PCB Footprint: R0402
R702 = RES: 0603,0Ohm,+/-5%; Part Reference: R702; CLASS: DISCRETE; Temp Range: ¨C55 ¡ãC to +155 ¡ãC; FPLIST: RC0603_OV,RC0603,R603-X2,0603_CC,IND_0603HP_NSP,CC0603_OV_NSP; CAD_APPROVED: Yes; MFG_PN01: RS-03000JT; MFG_NAME01: FENGHUA; Value: 0R; HEIGHT: 0.6MM; ROHS: Yes; PCB Footprint: R0603
R703 = RES: 0201,100K,+/-1%; Part Reference: R703; CLASS: DISCRETE; Tolerance: 5%; MFG_NAME01: FENGHUA; MFG_PN01: RC-01W1003FT; CAD_APPROVED: Yes; FPLIST: RC0402_25,RC0402_HD,0402_CC; VOLTAGE: 50V; Temp Range: -55C to +155C; Value: 100K; ROHS: Yes; HEIGHT: 0.40 MM; PCB Footprint: R0201
R704 = RES: 0603,0Ohm,+/-5%; Part Reference: R704; CLASS: DISCRETE; MFG_NAME01: FENGHUA; MFG_PN01: RS-03000JT; CAD_APPROVED: Yes; FPLIST: RC0603_OV,RC0603,R603-X2,0603_CC,IND_0603HP_NSP,CC0603_OV_NSP; Temp Range: ¨C55 ¡ãC to +155 ¡ãC; Value: 0R; ROHS: Yes; HEIGHT: 0.6MM; PCB Footprint: R0603
R705 = RES: 0201,100K,+/-1%; Part Reference: R705; CLASS: DISCRETE; Temp Range: -55C to +155C; VOLTAGE: 50V; Tolerance: 5%; MFG_NAME01: FENGHUA; MFG_PN01: RC-01W1003FT; CAD_APPROVED: Yes; FPLIST: RC0402_25,RC0402_HD,0402_CC; Value: 100K; ROHS: Yes; HEIGHT: 0.40 MM; PCB Footprint: R0201
R706 = RES: 0201,0Ohm,+/-5%; Part Reference: R706; CLASS: DISCRETE; VOLTAGE: 1/16W; Tolerance: 5%; MFG_NAME01: FENGHUA; MFG_PN01: RC-01000JT; CAD_APPROVED: Yes; FPLIST: RC0402_25,RC0402_HD,RC0402_X2,0402_CC; Value: 0R; ROHS: Yes; HEIGHT: 0.45 MM; PCB Footprint: R0201
R707 = RES: 0201,0Ohm,+/-5%; Part Reference: R707; CLASS: DISCRETE; FPLIST: RC0402_25,RC0402_HD,RC0402_X2,0402_CC; CAD_APPROVED: Yes; MFG_PN01: RC-01000JT; MFG_NAME01: FENGHUA; Tolerance: 5%; VOLTAGE: 1/16W; Value: 0R; HEIGHT: 0.45 MM; ROHS: Yes; PCB Footprint: R0201
R708 = RES: 0201,0Ohm,+/-5%; Part Reference: R708; CLASS: DISCRETE; VOLTAGE: 1/16W; FPLIST: RC0402_25,RC0402_HD,RC0402_X2,0402_CC; CAD_APPROVED: Yes; MFG_PN01: RC-01000JT; MFG_NAME01: FENGHUA; Tolerance: 5%; Value: 0R; HEIGHT: 0.45 MM; ROHS: Yes; PCB Footprint: R0201
R709 = RES: 0603,0Ohm,+/-5%; Part Reference: R709; CLASS: DISCRETE; Temp Range: ¨C55 ¡ãC to +155 ¡ãC; FPLIST: RC0603_OV,RC0603,R603-X2,0603_CC,IND_0603HP_NSP,CC0603_OV_NSP; CAD_APPROVED: Yes; MFG_PN01: RS-03000JT; MFG_NAME01: FENGHUA; Value: 0R; HEIGHT: 0.6MM; ROHS: Yes; PCB Footprint: R0603
R710 = RES: 0201,0Ohm,+/-5%; Part Reference: R710; CLASS: DISCRETE; VOLTAGE: 1/16W; FPLIST: RC0402_25,RC0402_HD,RC0402_X2,0402_CC; CAD_APPROVED: Yes; MFG_PN01: RC-01000JT; MFG_NAME01: FENGHUA; Tolerance: 5%; Value: 0R; HEIGHT: 0.45 MM; ROHS: Yes; PCB Footprint: R0201
R712 = RES: 0201,1.5K,+/-1%; Part Reference: R712; CLASS: DISCRETE; Tolerance: 5%; MFG_NAME01: FENGHUA; MFG_PN01: RC-01W1501FT; Temp_Range: -55C to +155C; CAD_APPROVED: Yes; FPLIST: RC0402_25,RC0402_HD,0402_CC,RC0402_X2; VOLTAGE: 50V; Value: 1.5K; ROHS: Yes; HEIGHT: 0.41mm; Temp Range: -55C to +155C; PCB Footprint: R0201
R713 = RES: 0201,1.5K,+/-1%; Part Reference: R713; CLASS: DISCRETE; VOLTAGE: 50V; Temp Range: -55C to +155C; FPLIST: RC0402_25,RC0402_HD,0402_CC,RC0402_X2; CAD_APPROVED: Yes; MFG_PN01: RC-01W1501FT; MFG_NAME01: FENGHUA; Tolerance: 5%; Value: 1.5K; HEIGHT: 0.41mm; Temp_Range: -55C to +155C; ROHS: Yes; PCB Footprint: R0201
R714 = RES: 0201,0Ohm,+/-5%; Part Reference: R714; CLASS: DISCRETE; Tolerance: 5%; MFG_NAME01: FENGHUA; MFG_PN01: RC-01000JT; CAD_APPROVED: Yes; FPLIST: RC0402_25,RC0402_HD,RC0402_X2,0402_CC; VOLTAGE: 1/16W; Value: 0R; ROHS: Yes; HEIGHT: 0.45 MM; PCB Footprint: R0201
R715 = RES: 0201,0Ohm,+/-5%; Part Reference: R715; CLASS: DISCRETE; Tolerance: 5%; MFG_NAME01: FENGHUA; MFG_PN01: RC-01000JT; CAD_APPROVED: Yes; FPLIST: RC0402_25,RC0402_HD,RC0402_X2,0402_CC; VOLTAGE: 1/16W; Value: 0R; ROHS: Yes; HEIGHT: 0.45 MM; PCB Footprint: R0201
R716 = RES: 0402,0Ohm,+/-1%; Part Reference: R716; CLASS: DISCRETE; VOLTAGE: 1/16W; Tolerance: 5%; MFG_NAME01: FENGHUA; MFG_PN01: RC-02000FT; CAD_APPROVED: Yes; FPLIST: RC0402_25,RC0402_HD,RC0402_X2,0402_CC; Value: 0R; ROHS: Yes; HEIGHT: 0.45 MM; PCB Footprint: R0402
R718 = RES: 0402,0Ohm,+/-1%; Part Reference: R718; CLASS: DISCRETE; VOLTAGE: 1/16W; Tolerance: 5%; MFG_NAME01: FENGHUA; MFG_PN01: RC-02000FT; CAD_APPROVED: Yes; FPLIST: RC0402_25,RC0402_HD,RC0402_X2,0402_CC; Value: 0R; ROHS: Yes; HEIGHT: 0.45 MM; PCB Footprint: R0402
R720 = RES: 0201,1M,+/-1%; Part Reference: R720; CLASS: DISCRETE; FPLIST: RC0201,0201_CC; CAD_APPROVED: Yes; Temp_Range: 55¡ãC ~ 125¡ãC; MFG_PN01: RC-01W1004FT; MFG_NAME01: FENGHUA; Tolerance: 5%; VOLTAGE: 25V; Value: 1M; HEIGHT: 0.26MM; ROHS: Yes; Temp Range: 55¡ãC ~ 125¡ãC; PCB Footprint: R0201
R723 = RES: 0402,0Ohm,+/-1%; Part Reference: R723; CLASS: DISCRETE; VOLTAGE: 1/16W; Tolerance: 5%; MFG_NAME01: FENGHUA; MFG_PN01: RC-02000FT; CAD_APPROVED: Yes; FPLIST: RC0402_25,RC0402_HD,RC0402_X2,0402_CC; Value: 0R; ROHS: Yes; HEIGHT: 0.45 MM; PCB Footprint: R0402
R812 = RES: 0402,1K,+/-1%; Part Reference: R812; CLASS: DISCRETE; MFG_PN01: RC-02K1001FT; MFG_NAME01: FENGHUA; VOLTAGE: 1/16W; CAD_APPROVED: Yes; Tolerance: 1%; FPLIST: RC0402_25,RC0402_HD,RC0402_X2,0402_CC; Value: 1K; ROHS: Yes; HEIGHT: 0.4MM; PCB Footprint: R0402
R2569 = RES: 0201,0Ohm,+/-5%; Part Reference: R2569; CLASS: DISCRETE; Tolerance: 5%; MFG_NAME01: FENGHUA; MFG_PN01: RC-01000JT; CAD_APPROVED: Yes; FPLIST: RC0402_25,RC0402_HD,RC0402_X2,0402_CC; VOLTAGE: 1/16W; Value: 0R; ROHS: Yes; HEIGHT: 0.45 MM; PCB Footprint: R0201
R2570 = RES: 0201,0Ohm,+/-5%; Part Reference: R2570; CLASS: DISCRETE; VOLTAGE: 1/16W; FPLIST: RC0402_25,RC0402_HD,RC0402_X2,0402_CC; CAD_APPROVED: Yes; MFG_PN01: RC-01000JT; MFG_NAME01: FENGHUA; Tolerance: 5%; Value: 0R; HEIGHT: 0.45 MM; ROHS: Yes; PCB Footprint: R0201
TP702 = T POINT R: no part to order; Part Reference: TP702; ASSY_OPT: DNP; CLASS: IC; MFG_NAME01: NOT A COMPONENT; CAD_APPROVED: Yes; MFG_PN01: NOT A COMPONENT; ROHS: Yes; HEIGHT: 0.1MM; PCB Footprint: tpad_020
TP703 = T POINT R: no part to order; Part Reference: TP703; ASSY_OPT: DNP; CLASS: IC; MFG_NAME01: NOT A COMPONENT; CAD_APPROVED: Yes; MFG_PN01: NOT A COMPONENT; ROHS: Yes; HEIGHT: 0.1MM; PCB Footprint: tpad_020
TP706 = T POINT R: no part to order; Part Reference: TP706; ASSY_OPT: DNP; CLASS: IC; MFG_NAME01: NOT A COMPONENT; CAD_APPROVED: Yes; MFG_PN01: NOT A COMPONENT; ROHS: Yes; HEIGHT: 0.1MM; PCB Footprint: tpad_020
TP707 = T POINT R: no part to order; Part Reference: TP707; ASSY_OPT: DNP; CLASS: IC; CAD_APPROVED: Yes; MFG_PN01: NOT A COMPONENT; HEIGHT: 0.1MM; ROHS: Yes; MFG_NAME01: NOT A COMPONENT; PCB Footprint: tpad_020
TP708 = T POINT R: no part to order; Part Reference: TP708; ASSY_OPT: DNP; CLASS: IC; MFG_NAME01: NOT A COMPONENT; CAD_APPROVED: Yes; MFG_PN01: NOT A COMPONENT; ROHS: Yes; HEIGHT: 0.1MM; PCB Footprint: tpad_020
TP709 = T POINT R: no part to order; Part Reference: TP709; ASSY_OPT: DNP; CLASS: IC; MFG_NAME01: NOT A COMPONENT; CAD_APPROVED: Yes; MFG_PN01: NOT A COMPONENT; ROHS: Yes; HEIGHT: 0.1MM; PCB Footprint: tpad_020
TP710 = T POINT R: no part to order; Part Reference: TP710; ASSY_OPT: DNP; CLASS: IC; CAD_APPROVED: Yes; MFG_PN01: NOT A COMPONENT; HEIGHT: 0.1MM; ROHS: Yes; MFG_NAME01: NOT A COMPONENT; PCB Footprint: tpad_020
TP711 = T POINT R: no part to order; Part Reference: TP711; ASSY_OPT: DNP; CLASS: IC; MFG_NAME01: NOT A COMPONENT; CAD_APPROVED: Yes; MFG_PN01: NOT A COMPONENT; ROHS: Yes; HEIGHT: 0.1MM; PCB Footprint: tpad_020
TP712 = T POINT R: no part to order; Part Reference: TP712; ASSY_OPT: DNP; CLASS: IC; MFG_NAME01: NOT A COMPONENT; CAD_APPROVED: Yes; MFG_PN01: NOT A COMPONENT; ROHS: Yes; HEIGHT: 0.1MM; PCB Footprint: tpad_020
TP713 = T POINT R: no part to order; Part Reference: TP713; ASSY_OPT: DNP; CLASS: IC; MFG_NAME01: NOT A COMPONENT; CAD_APPROVED: Yes; MFG_PN01: NOT A COMPONENT; ROHS: Yes; HEIGHT: 0.1MM; PCB Footprint: tpad_020
TP714 = T POINT R: no part to order; Part Reference: TP714; ASSY_OPT: DNP; CLASS: IC; CAD_APPROVED: Yes; MFG_PN01: NOT A COMPONENT; HEIGHT: 0.1MM; ROHS: Yes; MFG_NAME01: NOT A COMPONENT; PCB Footprint: tpad_015
TP915 = T POINT R: no part to order; Part Reference: TP915; ASSY_OPT: DNP; CLASS: IC; CAD_APPROVED: Yes; MFG_NAME01: NOT A COMPONENT; HEIGHT: 0.1MM; ROHS: Yes; MFG_PN01: NOT A COMPONENT; PCB Footprint: tpad_020
TP916 = T POINT R: no part to order; Part Reference: TP916; ASSY_OPT: DNP; CLASS: IC; CAD_APPROVED: Yes; MFG_NAME01: NOT A COMPONENT; HEIGHT: 0.1MM; ROHS: Yes; MFG_PN01: NOT A COMPONENT; PCB Footprint: tpad_020
TP1087 = T POINT R: no part to order; Part Reference: TP1087; ASSY_OPT: DNP; CLASS: IC; CAD_APPROVED: Yes; MFG_NAME01: NOT A COMPONENT; HEIGHT: 0.1MM; ROHS: Yes; MFG_PN01: NOT A COMPONENT; PCB Footprint: tpad_020
TP1088 = T POINT R: no part to order; Part Reference: TP1088; ASSY_OPT: DNP; CLASS: IC; MFG_PN01: NOT A COMPONENT; CAD_APPROVED: Yes; MFG_NAME01: NOT A COMPONENT; ROHS: Yes; HEIGHT: 0.1MM; PCB Footprint: tpad_020
TP1089 = T POINT R: no part to order; Part Reference: TP1089; ASSY_OPT: DNP; CLASS: IC; MFG_PN01: NOT A COMPONENT; CAD_APPROVED: Yes; MFG_NAME01: NOT A COMPONENT; ROHS: Yes; HEIGHT: 0.1MM; PCB Footprint: tpad_020
TP1090 = T POINT R: no part to order; Part Reference: TP1090; ASSY_OPT: DNP; CLASS: IC; MFG_PN01: NOT A COMPONENT; CAD_APPROVED: Yes; MFG_NAME01: NOT A COMPONENT; ROHS: Yes; HEIGHT: 0.1MM; PCB Footprint: tpad_020
TP1091 = T POINT R: no part to order; Part Reference: TP1091; ASSY_OPT: DNP; CLASS: IC; MFG_PN01: NOT A COMPONENT; CAD_APPROVED: Yes; MFG_NAME01: NOT A COMPONENT; ROHS: Yes; HEIGHT: 0.1MM; PCB Footprint: tpad_020
TP1092 = T POINT R: no part to order; Part Reference: TP1092; ASSY_OPT: DNP; CLASS: IC; MFG_PN01: NOT A COMPONENT; CAD_APPROVED: Yes; MFG_NAME01: NOT A COMPONENT; ROHS: Yes; HEIGHT: 0.1MM; PCB Footprint: tpad_020
TP1093 = T POINT R: no part to order; Part Reference: TP1093; ASSY_OPT: DNP; CLASS: IC; MFG_PN01: NOT A COMPONENT; CAD_APPROVED: Yes; MFG_NAME01: NOT A COMPONENT; ROHS: Yes; HEIGHT: 0.1MM; PCB Footprint: tpad_020
TP1094 = T POINT R: no part to order; Part Reference: TP1094; ASSY_OPT: DNP; CLASS: IC; MFG_PN01: NOT A COMPONENT; CAD_APPROVED: Yes; MFG_NAME01: NOT A COMPONENT; ROHS: Yes; HEIGHT: 0.1MM; PCB Footprint: tpad_020
TP1095 = T POINT R: no part to order; Part Reference: TP1095; ASSY_OPT: DNP; CLASS: IC; MFG_PN01: NOT A COMPONENT; CAD_APPROVED: Yes; MFG_NAME01: NOT A COMPONENT; ROHS: Yes; HEIGHT: 0.1MM; PCB Footprint: tpad_020
U701 = PCA9451AHNY: PCA9451AHN,HVQFN56; Part Reference: U701; SWAP_INFO: (S1+S2+S3); SPLIT_INST: TRUE; CLASS: IC; CAD_APPROVED: Yes; PRE_APN: 315-83273; MFG_NAME01: NXP SEMICONDUCTORS; 3D_Mechanical_Footprint_File: ftp://fcl.am.freescale.net/ALLEGRO/step/hvqfn56_0p4_7x7_ep4p7mm.step; Value: PCA9451AHNY; Package Size: 7x7; HEIGHT: 1MM; ROHS: Yes; MFG_PN01: PCA9451AHNY; PCB Footprint: hvqfn56_0p4_7x7_ep4p7mm